# EAGLE design car_battery_check (EAGLE 6.4)
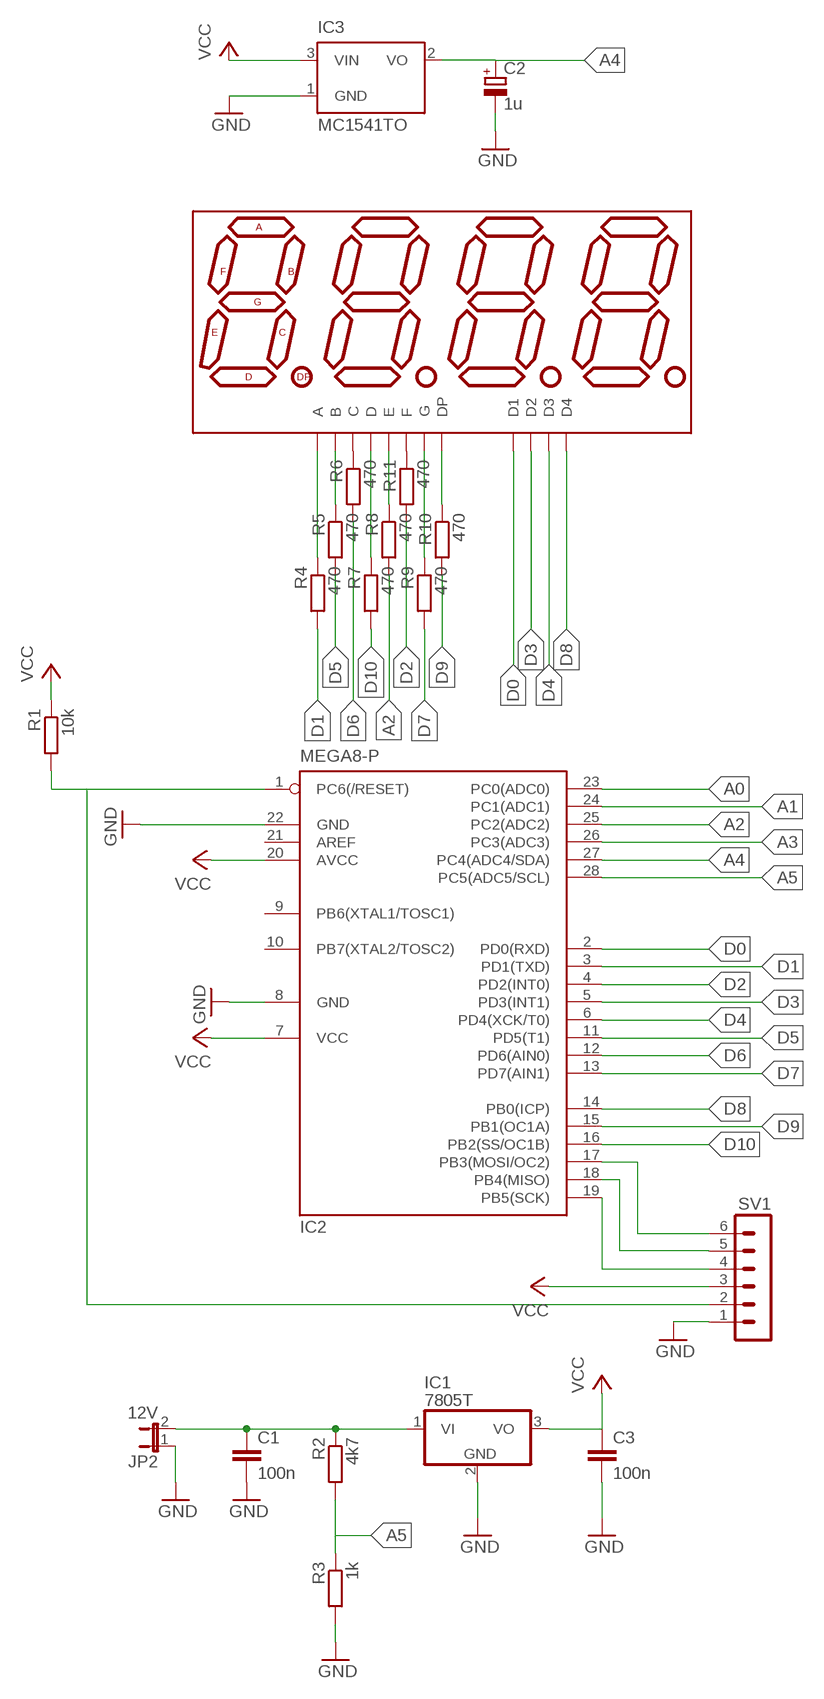
[diagram p0: schematic, sheet 1]

## Parts
C1  100n  C-EU025-024X044  [C025-024X044]
C2  1u  CPOL-EUE2,5-6E  [E2,5-6E]
C3  100n  C-EU025-024X044  [C025-024X044]
IC1  7805T  [TO220H]
IC2  MEGA8-P  [DIL28-3]
IC3  MC1541TO  [TO92]
JP2  12V  JP1E  [JP1]
R1  10k  R-EU_0617/17  [0617/17]
R2  4k7  R-EU_R2512  [R2512]
R3  1k  R-EU_0207/15  [0207/15]
R4  470  R-EU_0204/7  [0204/7]
R5  470  R-EU_0207/10  [0207/10]
R6  470  R-EU_0204/7  [0204/7]
R7  470  R-EU_0207/12  [0207/12]
R8  470  R-EU_0207/15  [0207/15]
R9  470  R-EU_0204/7  [0204/7]
R10  470  R-EU_0204/7  [0204/7]
R11  470  R-EU_0204/7  [0204/7]
SV1  MA06-1  [MA06-1]
U$1  7-SEGMENT-4DIGIT-COUNTERPTH  [7-SEGMENT-4DIGIT-COUNTER]

## Nets
A0: IC2.23(PC0(ADC0))
A1: IC2.24(PC1(ADC1))
A2: IC2.25(PC2(ADC2)) R8.2
A3: IC2.26(PC3(ADC3))
A4: C2.+ IC2.27(PC4(ADC4/SDA)) IC3.2(VO)
A5: IC2.28(PC5(ADC5/SCL)) R2.2 R3.1
D0: IC2.2(PD0(RXD)) U$1.12(D1)
D1: IC2.3(PD1(TXD)) R4.2
D2: IC2.4(PD2(INT0)) R11.2
D3: IC2.5(PD3(INT1)) U$1.9(D2)
D4: IC2.6(PD4(XCK/T0)) U$1.8(D3)
D5: IC2.11(PD5(T1)) R5.2
D6: IC2.12(PD6(AIN0)) R6.2
D7: IC2.13(PD7(AIN1)) R9.2
D8: IC2.14(PB0(ICP)) U$1.6(D4)
D9: IC2.15(PB1(OC1A)) R10.2
D10: IC2.16(PB2(SS/OC1B)) R7.2
GND: C1.2 C2.- C3.2 IC1.2(GND) IC2.8(GND) IC2.22(GND) IC3.1(GND) JP2.1 R3.2 SV1.1
N$1: C1.1 IC1.1(VI) JP2.2 R2.1
N$2: R4.1 U$1.11(A)
N$3: R5.1 U$1.7(B)
N$4: R6.1 U$1.4(C)
N$5: IC2.19(PB5(SCK)) SV1.4
N$6: IC2.18(PB4(MISO)) SV1.5
N$7: IC2.17(PB3(MOSI/OC2)) SV1.6
N$8: R7.1 U$1.2(D)
N$9: R8.1 U$1.1(E)
N$10: R9.1 U$1.5(G)
N$11: R10.1 U$1.3(DP)
N$12: R11.1 U$1.10(F)
N$17: IC2.1(PC6(/RESET)) R1.2 SV1.2
VCC: C3.1 IC1.3(VO) IC2.7(VCC) IC2.20(AVCC) IC3.3(VIN) R1.1 SV1.3
Unconnected: IC2.9(PB6(XTAL1/TOSC1)) IC2.10(PB7(XTAL2/TOSC2)) IC2.21(AREF)

## Library data of the parts
C1 C3 = rcl:C-EU: CAPACITOR, European symbol
C2 = rcl:CPOL-EU: POLARIZED CAPACITOR, European symbol
IC1 = linear:78*: Positive VOLTAGE REGULATOR Source: http://cache.national.com/ds/LM/LM78L05.pdf http://www.fairchildsemi.com/ds/LM/LM7805.pdf
IC2 = atmel:MEGA8-P: MICROCONTROLLER 8 Kbytes FLASH, 1 kbytes SRAM, 512 bytes EEPROM, USART, 4-channel 10 bit ADC, 2-channel 8 bit ADC Pin compatible with Atmega48, ATMega88, ATMega168 Source: avr.lbr
IC3 = microchip:MC15*: 2.5V and 4.096V Voltage References Source: http://www.microchip.com .. 21653b.pdf; OC_FARNELL: unknown; OC_NEWARK: unknown
JP2 = jumper:JP1E: JUMPER
R1-R11 = rcl:R-EU_: RESISTOR, European symbol
SV1 = con-lstb:MA06-1: PIN HEADER; OC_FARNELL: unknown; OC_NEWARK: unknown
U$1 = SparkFun-Displays:7-SEGMENT-4DIGIT-COUNTER

## Board
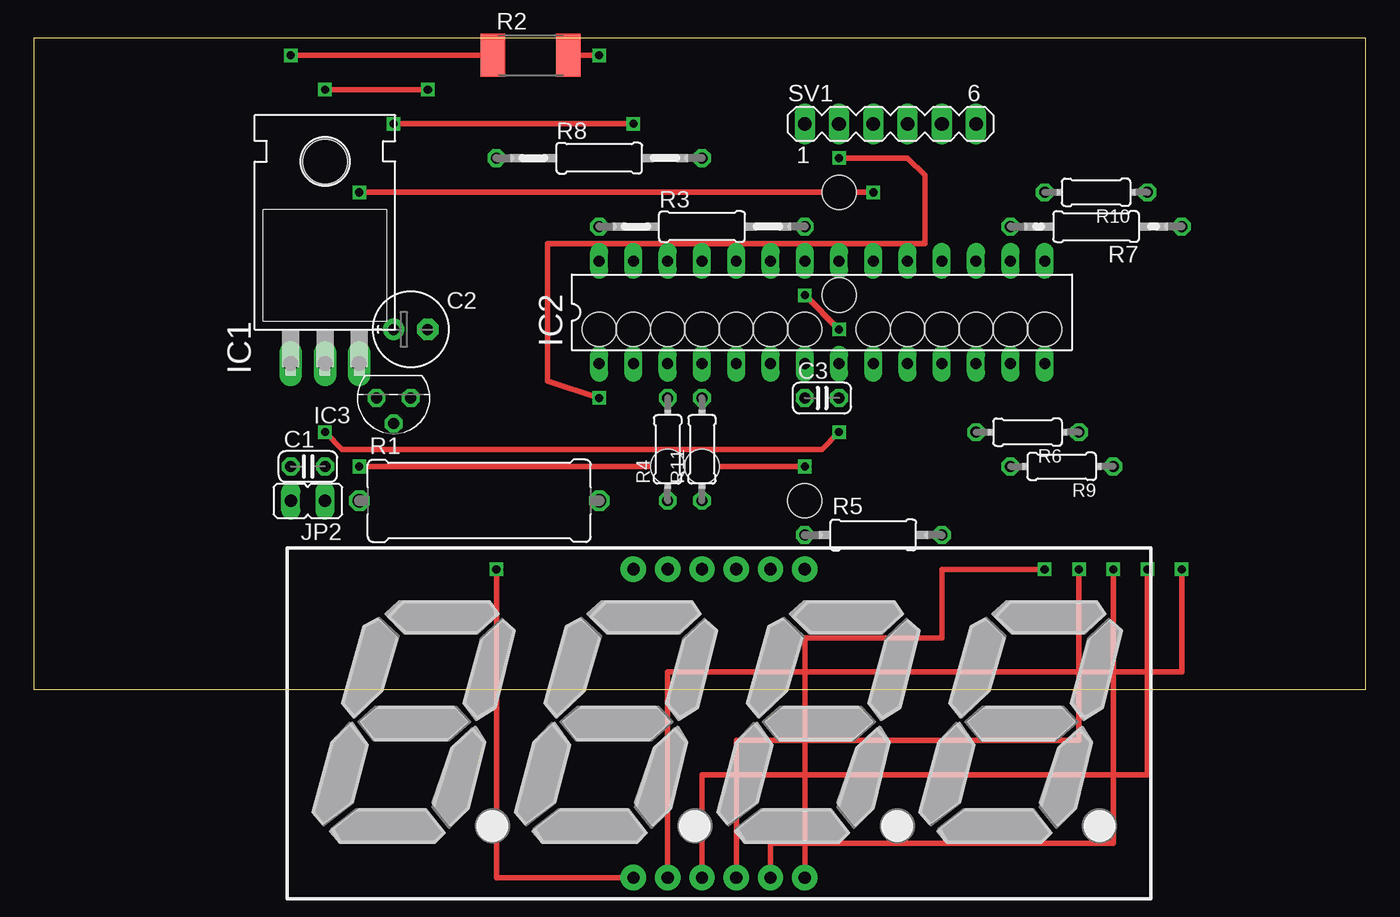
[diagram p1: board, top side]
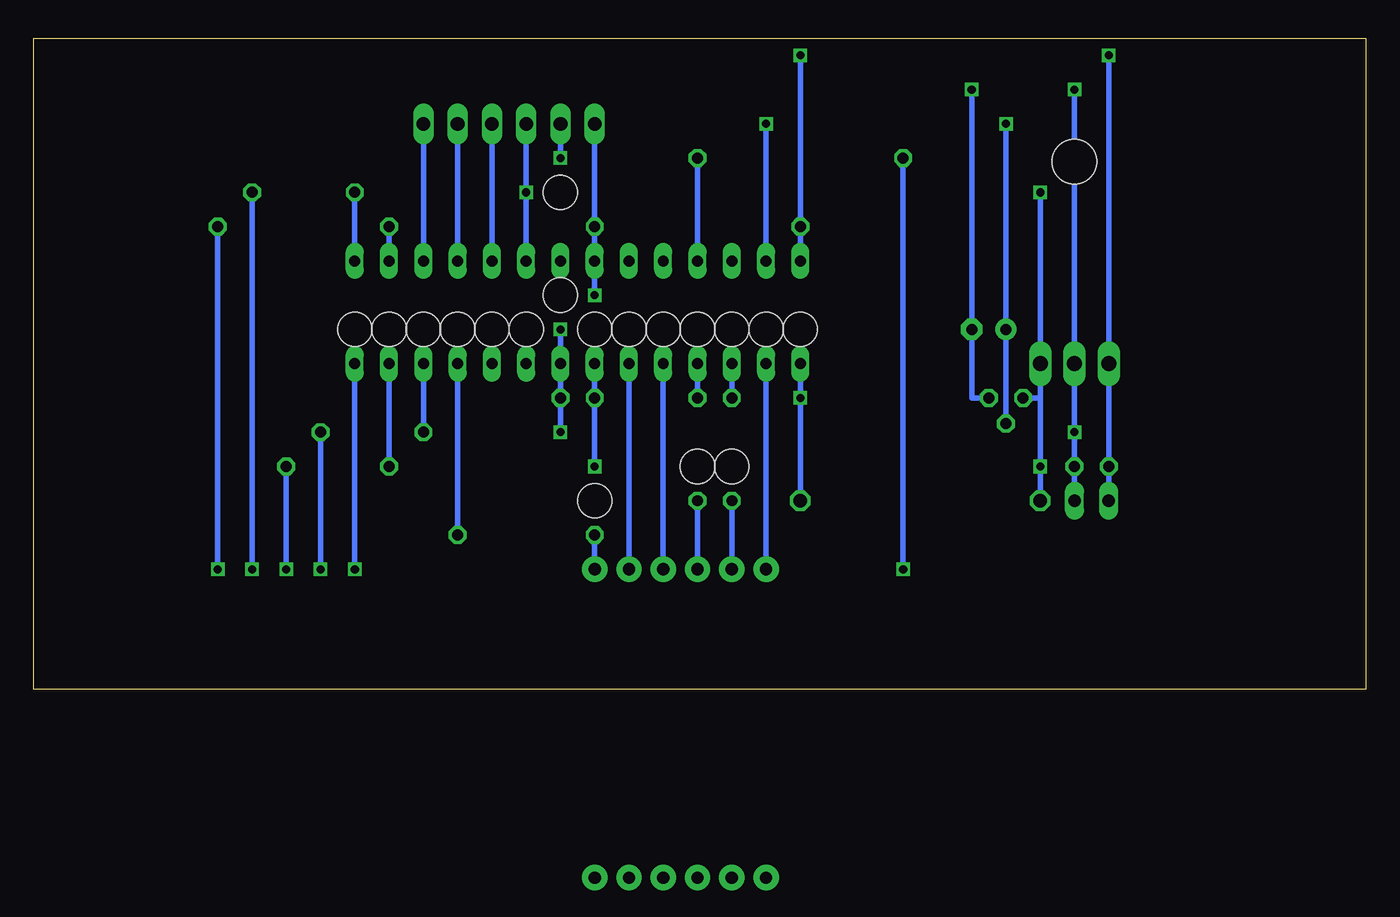
[diagram p2: board, bottom side, seen from below]

Size 98.73 x 48.25 mm. Coordinates in mm from the lower left corner, seen from the top.
Outline: 0,0 98.73,0 98.73,48.25 0,48.25 0,0
Copper layers (1*16): Top 0.035mm / dielectric 1.5mm / Bottom 0.035mm
Design rules "default": minimum track width 10mil, minimum drill 24mil, track to track 8mil, track to pad 8mil, pad to pad 8mil, via to via 8mil, smd to smd 8mil, copper to edge 40mil, drill to drill 8mil, minimum pad ring 10mil, minimum via ring 8mil, stop-mask expansion 4mil, vias tented up to drill 0mil, thermal gap 10mil
Holes 2.54 mm at 74.93,26.67 72.39,26.67 69.85,26.67 67.31,26.67 64.77,26.67 62.23,26.67 54.61,26.67 52.07,26.67 59.69,29.21 49.53,26.67 44.45,26.67 46.99,26.67 41.91,26.67 57.15,26.67 59.69,36.83 57.15,13.97 46.99,16.51 49.53,16.51

### Footprints (pad centres in the part's own frame; a part is rotated, then mirrored left to right if it is on the bottom)
C025-024X044 = drill 0.813 octagon: 1 -1.27,0; 2 1.27,0
E2,5-6E = drill 0.813 pad 1.575: + -1.27,0 | drill 0.813 pad 1.575 octagon: - 1.27,0
TO220H = drill 1.118 long: 1 -2.54,-10.16; 2 0,-10.16; 3 2.54,-10.16 | hole 3.302: 0,4.826
DIL28-3 = drill 0.813 long: 1 -16.51,-3.81; 2 -13.97,-3.81; 3 -11.43,-3.81; 4 -8.89,-3.81; 5 -6.35,-3.81; 6 -3.81,-3.81; 7 -1.27,-3.81; 8 1.27,-3.81; 9 3.81,-3.81; 10 6.35,-3.81; 11 8.89,-3.81; 12 11.43,-3.81; 13 13.97,-3.81; 14 16.51,-3.81; 15 16.51,3.81; 16 13.97,3.81; 17 11.43,3.81; 18 8.89,3.81; 19 6.35,3.81; 20 3.81,3.81; 21 1.27,3.81; 22 -1.27,3.81; 23 -3.81,3.81; 24 -6.35,3.81; 25 -8.89,3.81; 26 -11.43,3.81; 27 -13.97,3.81; 28 -16.51,3.81
TO92 = drill 0.813 octagon: 1 -1.27,0; 2 0,1.905; 3 1.27,0
JP1 = drill 0.914 long: 1 0,-1.27; 2 0,1.27
0617/17 = drill 1.016 octagon: 1 -8.89,0; 2 8.89,0
R2512 = smd 1.8 x 3.2: 1 -2.8,0; 2 2.8,0
0207/15 = drill 0.813 octagon: 1 -7.62,0; 2 7.62,0
0204/7 = drill 0.813 octagon: 1 -3.81,0; 2 3.81,0
0207/10 = drill 0.813 octagon: 1 -5.08,0; 2 5.08,0
0207/12 = drill 0.813 octagon: 1 -6.35,0; 2 6.35,0
MA06-1 = drill 1.016 long: 1 -6.35,0; 2 -3.81,0; 3 -1.27,0; 4 1.27,0; 5 3.81,0; 6 6.35,0
7-SEGMENT-4DIGIT-COUNTER = drill 0.9 pad 1.88: 1 -6.35,-11.43; 2 -3.81,-11.43; 3 -1.27,-11.43; 4 1.27,-11.43; 5 3.81,-11.43; 6 6.35,-11.43; 7 6.35,11.43; 8 3.81,11.43; 9 1.27,11.43; 10 -1.27,11.43; 11 -3.81,11.43; 12 -6.35,11.43

### Placement (x,y rotation side)
C1  20.32,16.51 0 top
C2  27.94,26.67 0 top
C3  58.42,21.59 0 top
IC1  21.59,34.29 0 top
IC2  58.42,27.94 0 top
IC3  26.67,21.59 180 top
JP2  20.32,13.97 90 top
R1  33.02,13.97 0 top
R2  36.83,46.99 0 top
R3  49.53,34.29 0 top
R4  46.99,17.78 90 top
R5  62.23,11.43 0 top
R6  73.66,19.05 180 top
R7  78.74,34.29 180 top
R8  41.91,39.37 0 top
R9  76.2,16.51 180 top
R10  78.74,36.83 180 top
R11  49.53,17.78 90 top
SV1  63.5,41.91 0 top
U$1  50.8,-2.54 0 top

### Tracks (layer width: path | path; a pad name or v marks a point on that pad's centre or on a via)
A2
  Bottom 0.406: R8.2 IC2.25
A4  (via drill 0.6)
  Top 0.406: v44.45,41.91 v26.67,41.91
  Bottom 0.406: C2.+ v26.67,41.91 IC3.2 | IC2.27 v44.45,41.91
A5  (via drill 0.6)
  Top 0.406: R2.2 v41.91,46.99
  Bottom 0.406: IC2.28 R3.1 v41.91,46.99
D0
  Bottom 0.406: IC2.2 U$1.12
D1
  Bottom 0.406: IC2.3 R4.2
D2
  Bottom 0.406: IC2.4 R11.2
D3
  Bottom 0.406: U$1.9 IC2.5
D4
  Bottom 0.406: IC2.6 U$1.8
D5
  Bottom 0.406: IC2.11 R5.2
D6
  Bottom 0.406: R6.2 IC2.12
D7
  Bottom 0.406: R9.2 IC2.13
D8  (via drill 0.6)
  Top 0.406: v74.93,8.89 67.31,8.89 67.31,3.81 57.15,3.81 U$1.6
  Bottom 0.406: IC2.14 v74.93,8.89
D9
  Bottom 0.406: R10.2 IC2.15
D10
  Bottom 0.406: IC2.16 R7.2
GND  (via drill 0.6)
  Top 0.406: v59.69,26.67 v57.15,29.21 | v21.59,19.05 22.86,17.78 58.42,17.78 v59.69,19.05 | v21.59,44.45 v29.21,44.45
  Bottom 0.406: v59.69,26.67 IC2.8 C3.2 v59.69,19.05 | v57.15,29.21 IC2.22 R3.2 SV1.1 | JP2.1 C1.2 v21.59,19.05 IC1.2 v21.59,44.45 | v29.21,44.45 C2.- 29.21,21.59 IC3.1
N$1  (via drill 0.6)
  Top 0.406: R2.1 34.03,46.73 33.02,46.99 v19.05,46.99
  Bottom 0.406: JP2.2 C1.1 IC1.1 v19.05,46.99
N$2
  Bottom 0.406: R4.1 U$1.11
N$3
  Bottom 0.406: R5.1 U$1.7
N$4  (via drill 0.6)
  Top 0.406: v77.47,8.89 77.47,-3.81 52.07,-3.81 U$1.4
  Bottom 0.406: R6.1 v77.47,8.89
N$5
  Bottom 0.406: IC2.19 SV1.4
N$6
  Bottom 0.406: IC2.18 SV1.5
N$7
  Bottom 0.406: IC2.17 SV1.6
N$8  (via drill 0.6)
  Top 0.406: v85.09,8.89 85.09,1.27 46.99,1.27 U$1.2
  Bottom 0.406: R7.1 v85.09,8.89
N$9  (via drill 0.6)
  Top 0.406: U$1.1 34.29,-13.97 v34.29,8.89
  Bottom 0.406: R8.1 v34.29,8.89
N$10  (via drill 0.6)
  Top 0.406: v80.01,8.89 80.01,-11.43 54.61,-11.43 U$1.5
  Bottom 0.406: R9.1 v80.01,8.89
N$11  (via drill 0.6)
  Top 0.406: v82.55,8.89 82.55,-6.35 49.53,-6.35 U$1.3
  Bottom 0.406: R10.1 v82.55,8.89
N$12
  Bottom 0.406: U$1.10 R11.1
N$17  (via drill 0.6)
  Top 0.406: v59.69,39.37 64.77,39.37 66.04,38.1 66.04,33.02 38.1,33.02 38.1,22.86 v41.91,21.59
  Bottom 0.406: IC2.1 v41.91,21.59 R1.2 | SV1.2 v59.69,39.37
VCC  (via drill 0.6)
  Top 0.406: v57.15,16.51 v24.13,16.51 | v62.23,36.83 v24.13,36.83
  Bottom 0.406: IC2.7 C3.1 v57.15,16.51 | SV1.3 v62.23,36.83 IC2.20 | 24.13,21.59 v24.13,16.51 R1.1 | 24.13,21.59 IC1.3 v24.13,36.83 | IC3.3 24.13,21.59